# EAGLE design mainv4 (EAGLE 9.2.0)
Custom Smart 12V Battery control system.
CNAME: Caravan 12V Control System; CREVISION: 4.0; DESIGNER: Tim McConnell, M0THM

## Sheet 1 of 2
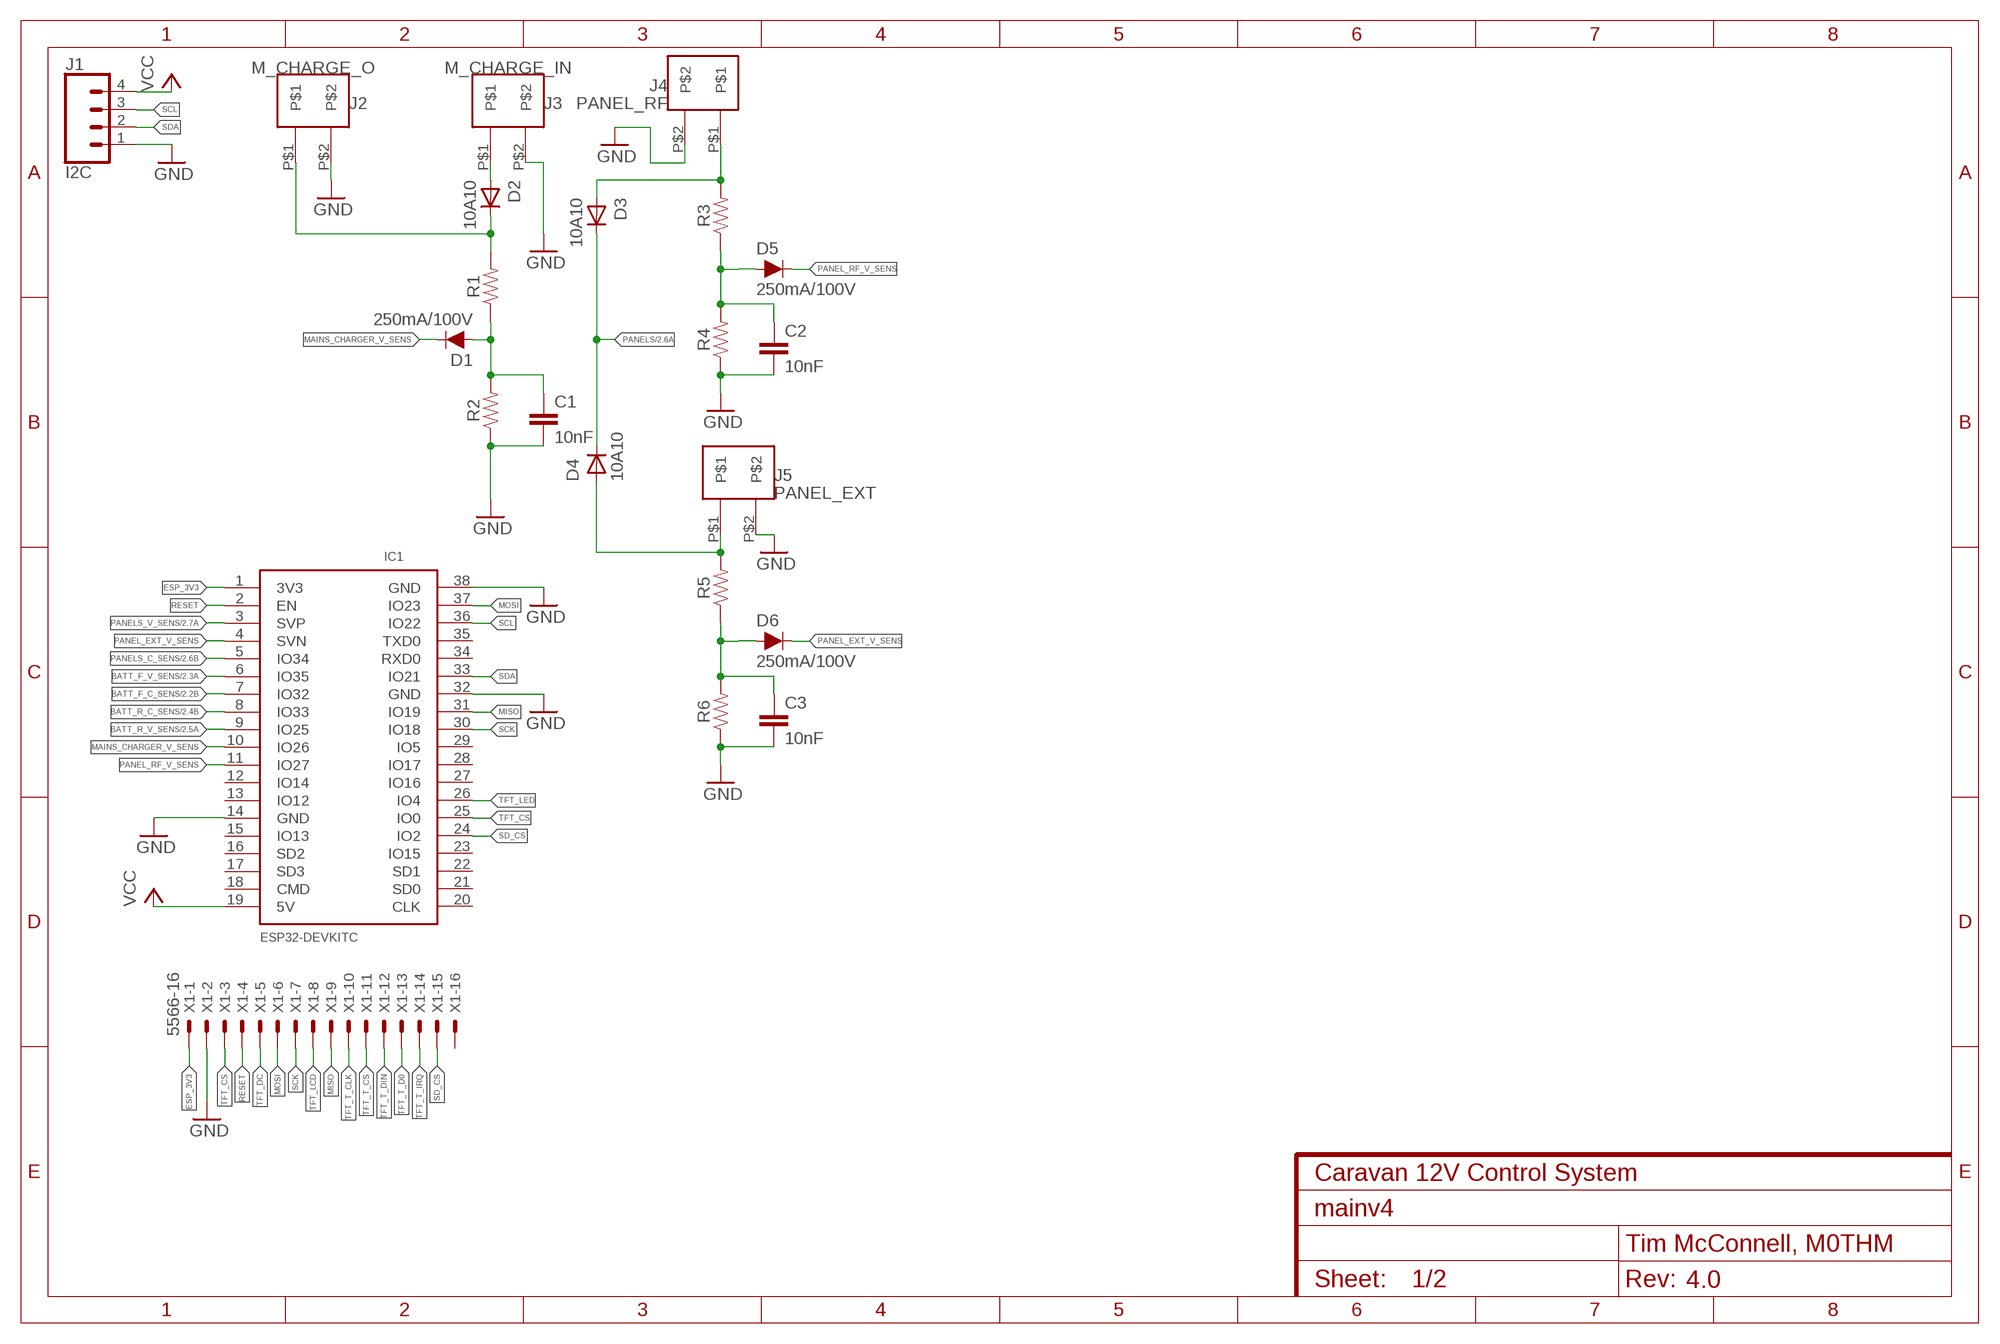
[diagram p0: schematic, sheet 1]

### Parts
C1  10nF  10NF-0603-50V-10%  [0603]
C2  10nF  10NF-0603-50V-10%  [0603]
C3  10nF  10NF-0603-50V-10%  [0603]
D1  250mA/100V  DIODE-BAS16J  [SOD-323]
D2  10A10  [AG]
D3  10A10  [AG]
D4  10A10  [AG]
D5  250mA/100V  DIODE-BAS16J  [SOD-323]
D6  250mA/100V  DIODE-BAS16J  [SOD-323]
IC1  ESP32DEVKITC  [ESP32-DEVKITC]
J1  I2C  CONN_04POLAR  [MOLEX-1X4]
J2  M_CHARGE_O  40A-2PIN  [40A-2PIN]
J3  M_CHARGE_IN  40A-2PIN  [40A-2PIN]
J4  PANEL_RF  40A-2PIN  [40A-2PIN]
J5  PANEL_EXT  40A-2PIN  [40A-2PIN]
R1  RESISTOR0805  [0805]
R2  RESISTOR0805  [0805]
R3  RESISTOR0805  [0805]
R4  RESISTOR0805  [0805]
R5  RESISTOR0805  [0805]
R6  RESISTOR0805  [0805]
X1  5566-16  [5566-16]

### Nets
BATT_F_C_SENS: IC1.7(IO32) ; also sheet 2
BATT_F_V_SENS: IC1.6(IO35) ; also sheet 2
BATT_R_C_SENS: IC1.8(IO33) ; also sheet 2
BATT_R_V_SENS: IC1.9(IO25) ; also sheet 2
ESP_3V3: IC1.1(3V3) X1.1
GND: C1.2 C2.2 C3.2 IC1.14(GND) IC1.32(GND) IC1.38(GND) J1.1 J2.P$2 J3.P$2 J4.P$2 J5.P$2 R2.1 R4.1 R6.1 X1.2 ; also sheet 2
MAINS_CHARGER_V_SENS: D1.C IC1.10(IO26)
MISO: IC1.31(IO19) X1.9
MOSI: IC1.37(IO23) X1.6
N$1: D2.A J3.P$1
N$2: D2.C J2.P$1 R1.2
N$13: D3.A J4.P$1 R3.2
N$14: C2.1 D5.A R3.1 R4.2
N$15: C3.1 D6.A R5.1 R6.2
N$16: D4.A J5.P$1 R5.2
N$17: C1.1 D1.A R1.1 R2.2
PANEL_EXT_V_SENS: D6.C IC1.4(SVN)
PANEL_RF_V_SENS: D5.C IC1.11(IO27)
PANELS: D3.C D4.C ; also sheet 2
PANELS_C_SENS: IC1.5(IO34) ; also sheet 2
PANELS_V_SENS: IC1.3(SVP) ; also sheet 2
RESET: IC1.2(EN) X1.4
SCK: IC1.30(IO18) X1.7
SCL: IC1.36(IO22) J1.3
SD_CS: IC1.24(IO2) X1.15
SDA: IC1.33(IO21) J1.2
TFT_CS: IC1.25(IO0) X1.3
TFT_DC: X1.5
TFT_LCD: X1.8
TFT_LED: IC1.26(IO4)
TFT_T_CLK: X1.10
TFT_T_CS: X1.11
TFT_T_D0: X1.13
TFT_T_DIN: X1.12
TFT_T_IRQ: X1.14
VCC: IC1.19(5V) J1.4 ; also sheet 2
Unconnected: IC1.12(IO14) IC1.13(IO12) IC1.15(IO13) IC1.16(SD2) IC1.17(SD3) IC1.18(CMD) IC1.20(CLK) IC1.21(SD0) IC1.22(SD1) IC1.23(IO15) IC1.27(IO16) IC1.28(IO17) IC1.29(IO5) IC1.34(RXD0) IC1.35(TXD0) X1.16

## Sheet 2 of 2
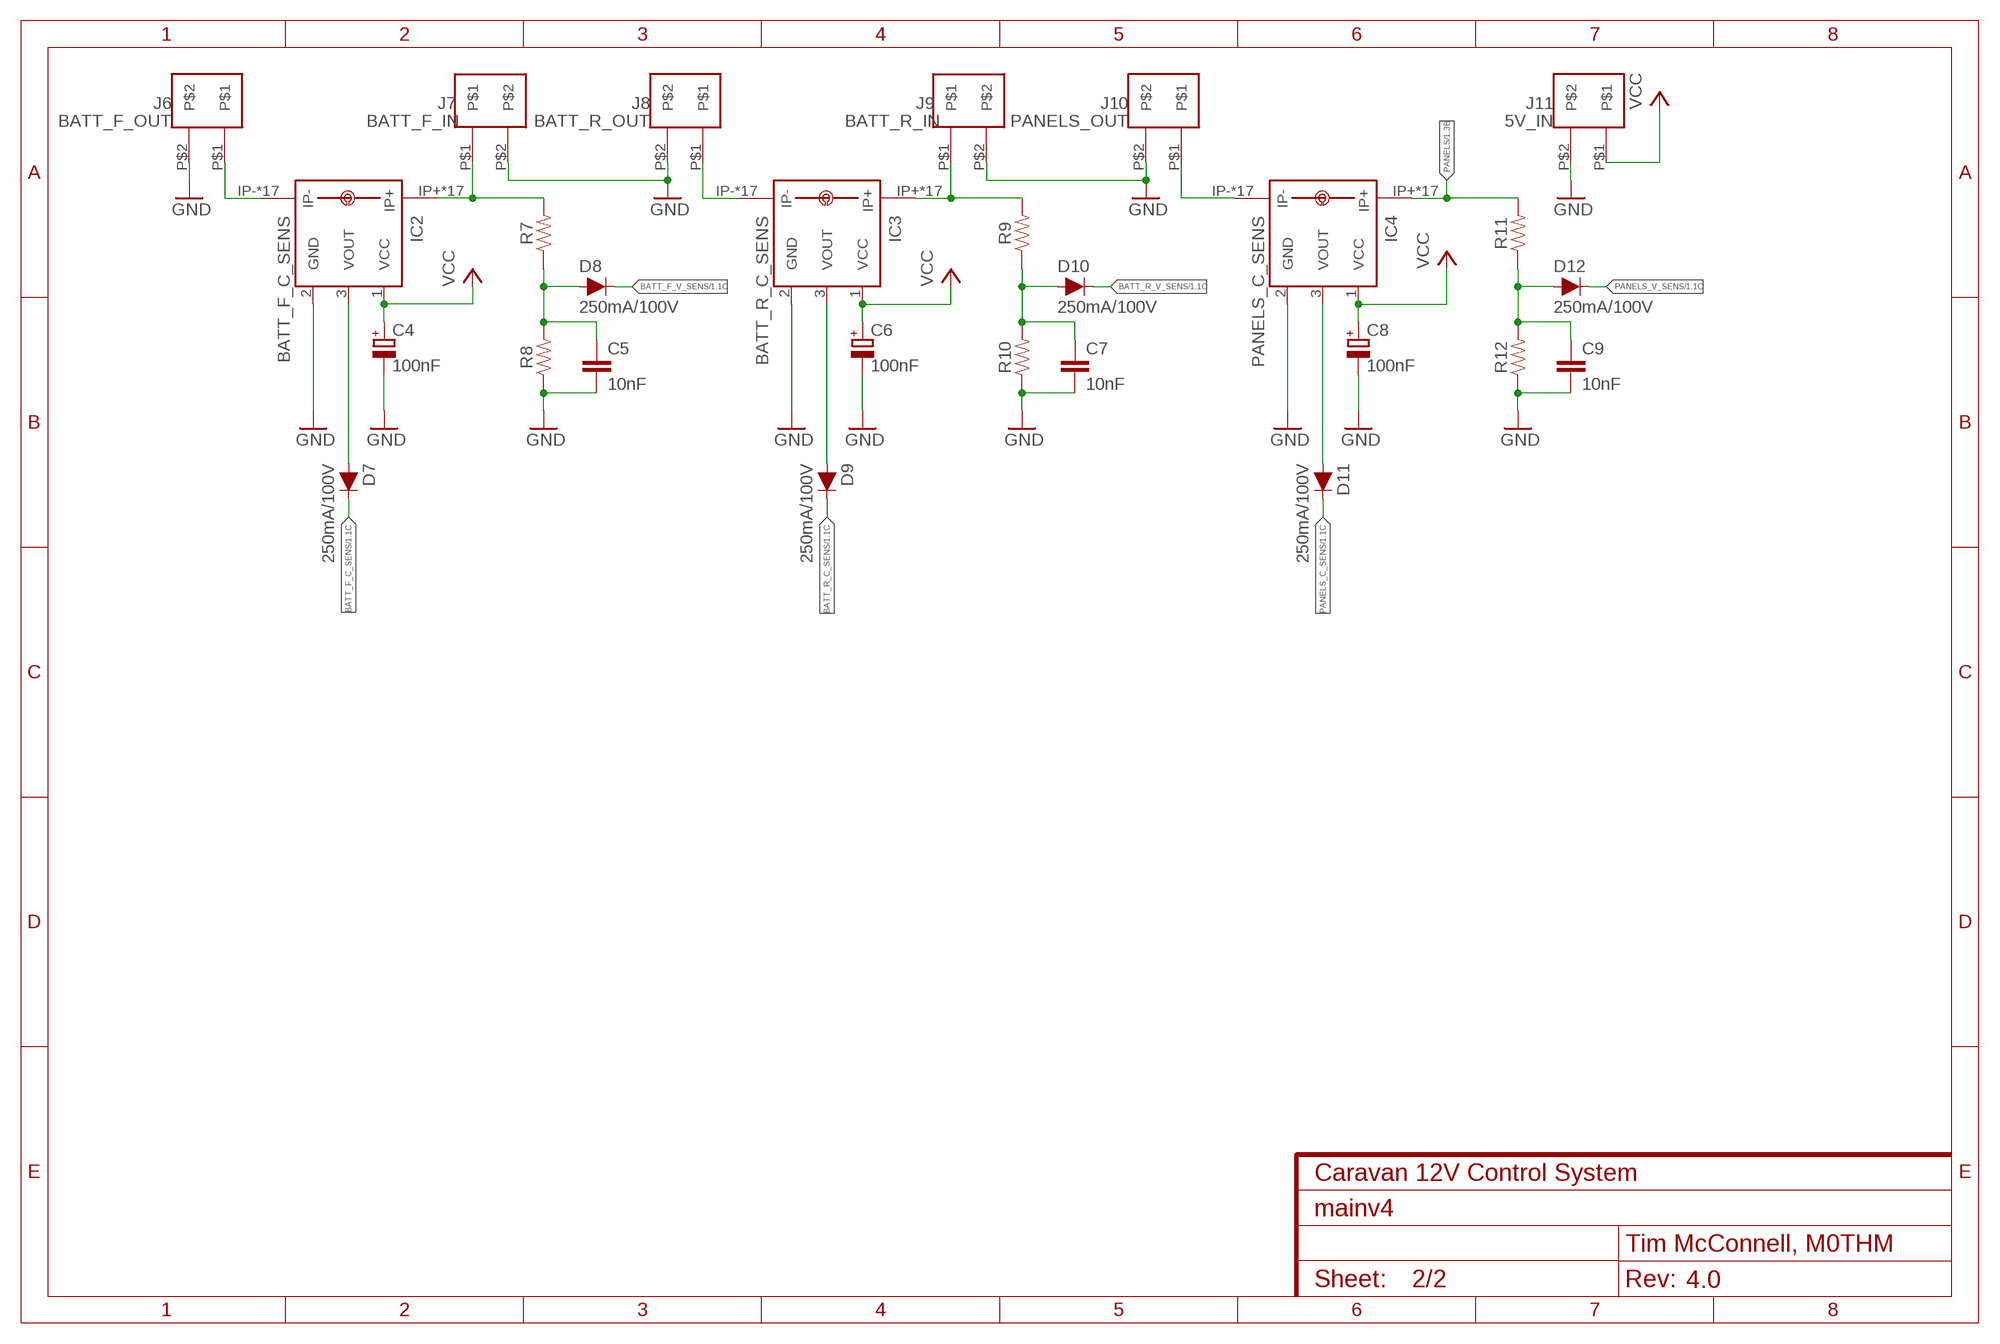
[diagram p1: schematic, sheet 2]

### Parts
C4  100nF  CPOL-EUE  [PANASONIC_E]
C5  10nF  10NF-0603-50V-10%  [0603]
C6  100nF  CPOL-EUE  [PANASONIC_E]
C7  10nF  10NF-0603-50V-10%  [0603]
C8  100nF  CPOL-EUE  [PANASONIC_E]
C9  10nF  10NF-0603-50V-10%  [0603]
D7  250mA/100V  DIODE-BAS16J  [SOD-323]
D8  250mA/100V  DIODE-BAS16J  [SOD-323]
D9  250mA/100V  DIODE-BAS16J  [SOD-323]
D10  250mA/100V  DIODE-BAS16J  [SOD-323]
D11  250mA/100V  DIODE-BAS16J  [SOD-323]
D12  250mA/100V  DIODE-BAS16J  [SOD-323]
IC2  BATT_F_C_SENS  ACS758ECB-200B-PFF-T  [CB-PFF]
IC3  BATT_R_C_SENS  ACS758ECB-200B-PFF-T  [CB-PFF]
IC4  PANELS_C_SENS  ACS758ECB-200B-PFF-T  [CB-PFF]
J6  BATT_F_OUT  40A-2PIN  [40A-2PIN]
J7  BATT_F_IN  40A-2PIN  [40A-2PIN]
J8  BATT_R_OUT  40A-2PIN  [40A-2PIN]
J9  BATT_R_IN  40A-2PIN  [40A-2PIN]
J10  PANELS_OUT  40A-2PIN  [40A-2PIN]
J11  5V_IN  40A-2PIN  [40A-2PIN]
R7  RESISTOR0805  [0805]
R8  RESISTOR0805  [0805]
R9  RESISTOR0805  [0805]
R10  RESISTOR0805  [0805]
R11  RESISTOR0805  [0805]
R12  RESISTOR0805  [0805]

### Nets
BATT_F_C_SENS: D7.C ; also sheet 1
BATT_F_V_SENS: D8.C ; also sheet 1
BATT_R_C_SENS: D9.C ; also sheet 1
BATT_R_V_SENS: D10.C ; also sheet 1
GND: C4.- C5.2 C6.- C7.2 C8.- C9.2 IC2.2(GND) IC3.2(GND) IC4.2(GND) J6.P$2 J7.P$2 J8.P$2 J9.P$2 J10.P$2 J11.P$2 R8.1 R10.1 R12.1 ; also sheet 1
N$3: IC2.IP- IC2.IP-@2(IP-) IC2.IP-@3(IP-) IC2.IP-@4(IP-) IC2.IP-@5(IP-) IC2.IP-@6(IP-) IC2.IP-@7(IP-) IC2.IP-@8(IP-) IC2.IP-@9(IP-) IC2.IP-@10(IP-) IC2.IP-@11(IP-) IC2.IP-@12(IP-) IC2.IP-@13(IP-) IC2.IP-@14(IP-) IC2.IP-@15(IP-) IC2.IP-@16(IP-) IC2.IP-@17(IP-) J6.P$1
N$11: D7.A IC2.3(VOUT)
N$20: IC2.IP+ IC2.IP+@2(IP+) IC2.IP+@3(IP+) IC2.IP+@4(IP+) IC2.IP+@5(IP+) IC2.IP+@6(IP+) IC2.IP+@7(IP+) IC2.IP+@8(IP+) IC2.IP+@9(IP+) IC2.IP+@10(IP+) IC2.IP+@11(IP+) IC2.IP+@12(IP+) IC2.IP+@13(IP+) IC2.IP+@14(IP+) IC2.IP+@15(IP+) IC2.IP+@16(IP+) IC2.IP+@17(IP+) J7.P$1 R7.2
N$21: C5.1 D8.A R7.1 R8.2
N$22: D9.A IC3.3(VOUT)
N$23: IC3.IP- IC3.IP-@2(IP-) IC3.IP-@3(IP-) IC3.IP-@4(IP-) IC3.IP-@5(IP-) IC3.IP-@6(IP-) IC3.IP-@7(IP-) IC3.IP-@8(IP-) IC3.IP-@9(IP-) IC3.IP-@10(IP-) IC3.IP-@11(IP-) IC3.IP-@12(IP-) IC3.IP-@13(IP-) IC3.IP-@14(IP-) IC3.IP-@15(IP-) IC3.IP-@16(IP-) IC3.IP-@17(IP-) J8.P$1
N$24: IC3.IP+ IC3.IP+@2(IP+) IC3.IP+@3(IP+) IC3.IP+@4(IP+) IC3.IP+@5(IP+) IC3.IP+@6(IP+) IC3.IP+@7(IP+) IC3.IP+@8(IP+) IC3.IP+@9(IP+) IC3.IP+@10(IP+) IC3.IP+@11(IP+) IC3.IP+@12(IP+) IC3.IP+@13(IP+) IC3.IP+@14(IP+) IC3.IP+@15(IP+) IC3.IP+@16(IP+) IC3.IP+@17(IP+) J9.P$1 R9.2
N$25: C7.1 D10.A R9.1 R10.2
N$26: D11.A IC4.3(VOUT)
N$27: IC4.IP- IC4.IP-@2(IP-) IC4.IP-@3(IP-) IC4.IP-@4(IP-) IC4.IP-@5(IP-) IC4.IP-@6(IP-) IC4.IP-@7(IP-) IC4.IP-@8(IP-) IC4.IP-@9(IP-) IC4.IP-@10(IP-) IC4.IP-@11(IP-) IC4.IP-@12(IP-) IC4.IP-@13(IP-) IC4.IP-@14(IP-) IC4.IP-@15(IP-) IC4.IP-@16(IP-) IC4.IP-@17(IP-) J10.P$1
N$28: C9.1 D12.A R11.1 R12.2
PANELS: IC4.IP+ IC4.IP+@2(IP+) IC4.IP+@3(IP+) IC4.IP+@4(IP+) IC4.IP+@5(IP+) IC4.IP+@6(IP+) IC4.IP+@7(IP+) IC4.IP+@8(IP+) IC4.IP+@9(IP+) IC4.IP+@10(IP+) IC4.IP+@11(IP+) IC4.IP+@12(IP+) IC4.IP+@13(IP+) IC4.IP+@14(IP+) IC4.IP+@15(IP+) IC4.IP+@16(IP+) IC4.IP+@17(IP+) R11.2 ; also sheet 1
PANELS_C_SENS: D11.C ; also sheet 1
PANELS_V_SENS: D12.C ; also sheet 1
VCC: C4.+ C6.+ C8.+ IC2.1(VCC) IC3.1(VCC) IC4.1(VCC) J11.P$1 ; also sheet 1

## Library data of the parts
C1-C3 C5 C7 C9 = SparkFun-Capacitors:10NF: 0.01uF/10nF/10,000pF ceramic capacitors A capacitor is a passive two-terminal electrical component used to store electrical energy temporarily in an electric field. CAP-09321; PROD_ID: CAP-00867
C4 C6 C8 = rcl:CPOL-EU: POLARIZED CAPACITOR, European symbol; SPICEPREFIX: C
D1 D5-D12 = SparkFun-DiscreteSemi:DIODE: Diode These are standard reverse protection diodes and small signal diodes. SparkFun Products: SparkFun SparkPunk Sound Kit <https://www.sparkfun.com/products/11177> SparkFun ESP8266 Thing <https://www.sparkfun.com/products/13231>; PROD_ID: DIO-09646
D2-D4 = m0thm:10A10
IC1 = ESP32-DEVKITC:ESP32DEVKITC
IC2-IC4 = allegro-2:ACS758*: Thermally Enhanced, Fully Integrated, Hall Effect-Based Linear Current Sensor with 100 micro Ohm Current Conductor display layer 49 Reference in BRD and place VIAs on circles Source: http://www.allegromicro.com/en/Products/Part_Numbers/0758/0758.pdf; MPN: ACS758ECB-200B-PFF-T; OC_FARNELL: 1718993; OC_NEWARK: 04R7127
J1 = SparkFun-Connectors:CONN_04: Multi connection point. Often used as Generic Header-pin footprint for 0.1 inch spaced/style header connections On any of the 0.1 inch spaced packages, you can populate with these: Break Away Headers - Straight <https://www.sparkfun.com/products/116> (PRT-00116) Break Away Male Headers - Right Angle <https://www.sparkfun.com/products/553> (PRT-00553) Female Headers <https://www.sparkfun.com/products/115> (PRT-00115) Break Away Headers - Machine Pin <https://www.sparkfun.com/products/117> (PRT-00117) Break Away Female Headers - Swiss Machine Pin <https://www.sparkfun.com/products/743> (PRT-00743) For SCREWTERMINALS and SPRING TERMINALS visit here: Screw Terimnals on SparkFun.com <https://www.sparkfun.com/search/results?term=Screw+Terminals> (5mm/3.5mm/2.54mm spacing) This device is also useful as a general connection point to wire up your design to another part of your project. Our various solder wires solder well into these plated through hole pads. Hook-Up Wire - Assortment (Stranded, 22 AWG) <https://www.sparkfun.com/products/11375> (PRT-11375) Hook-Up Wire - Assortment (Solid Core, 22 AWG) <https://www.sparkfun.com/products/11367> (PRT-11367) View the entire wire category on our website here <https://www.sparkfun.com/categories/141> Special notes: Molex polarized connector foot print use with SKU : PRT-08231 with associated crimp pins and housings. 1MM SMD Version SKU: PRT-10208; PROD_ID: CONN-08186; SF_ID: PRT-08231
J2-J11 = m0thm:40A-2PIN
R1-R12 = SparkFun-Resistors:RESISTOR: Generic Resistor Package
X1 = con-molex:5566-16: Mini FIT connector 16 pol Source: http://www.molex.com; MF: MOLEX; OC_FARNELL: unknown; OC_NEWARK: unknown

## Board
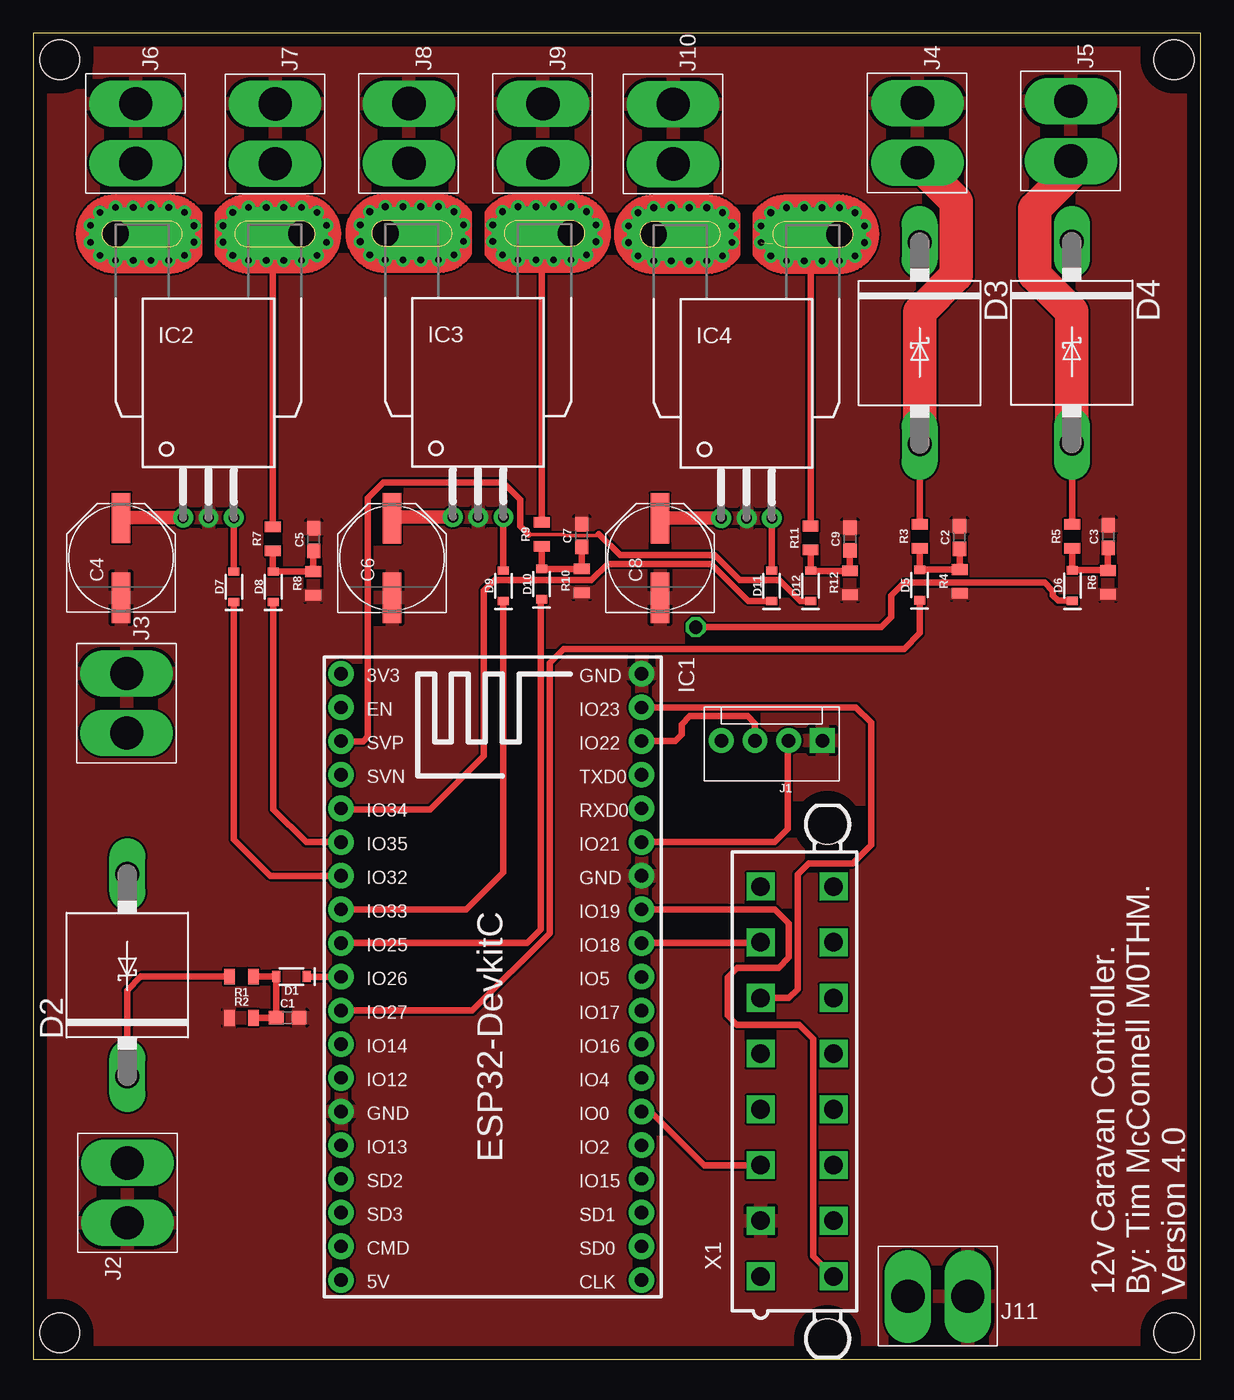
[diagram p2: board, top side]
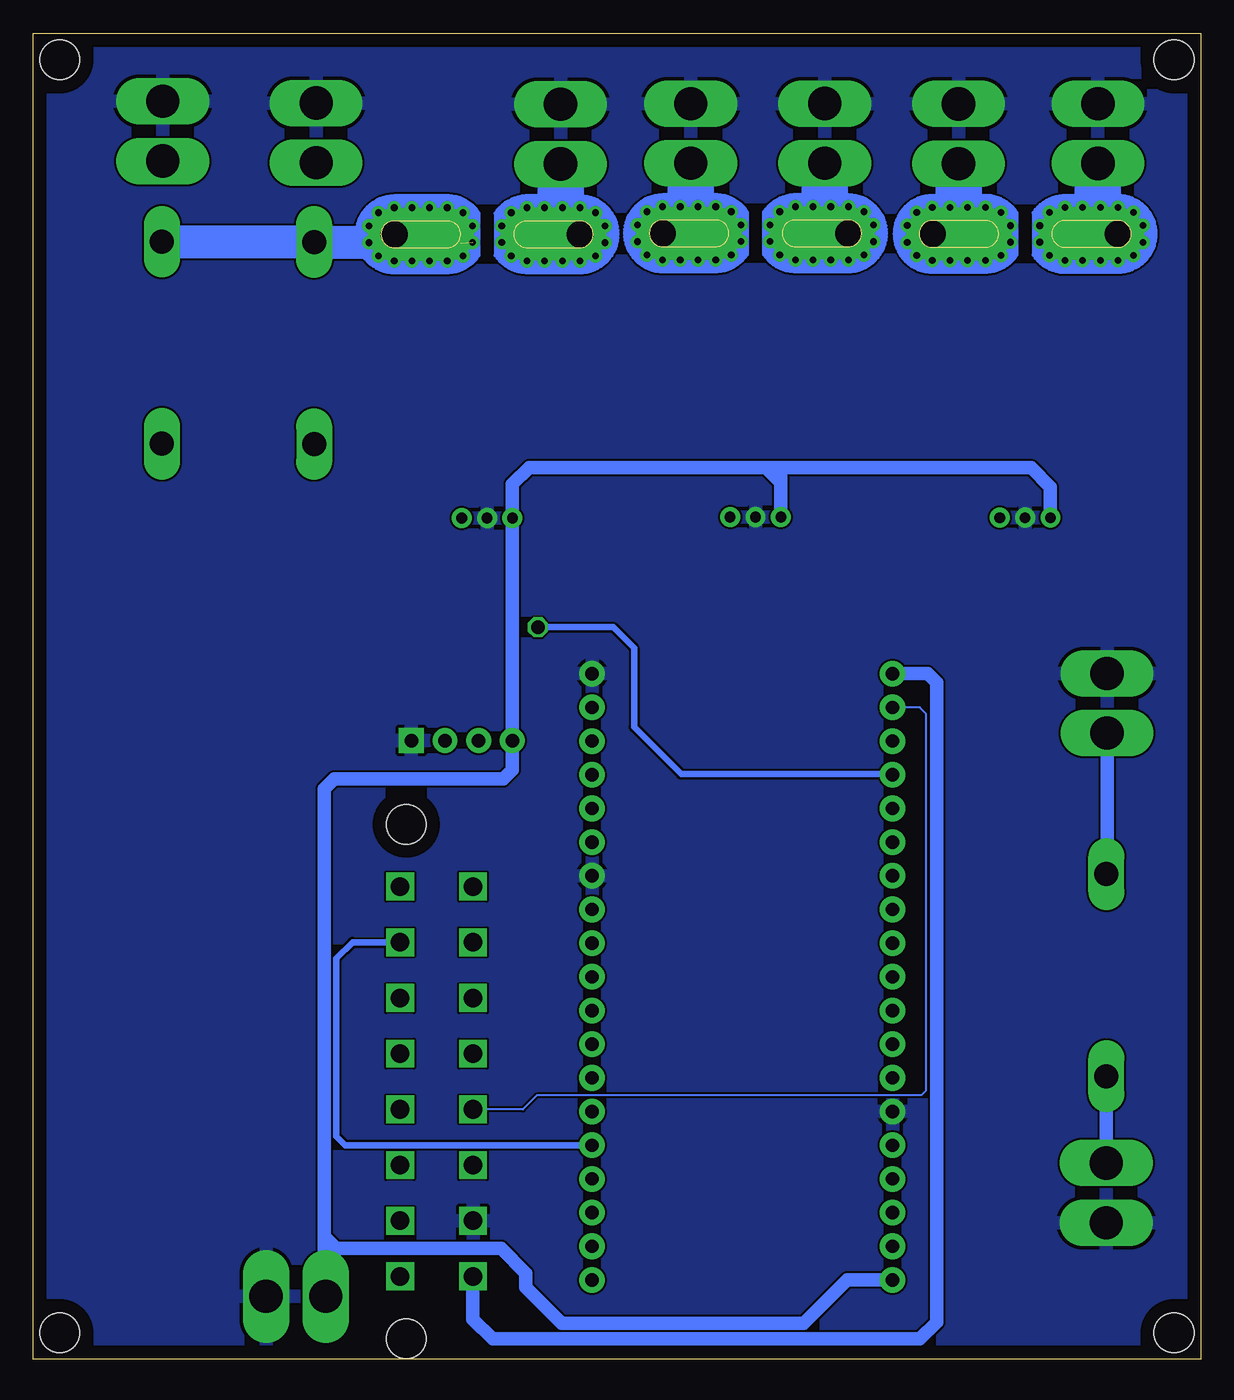
[diagram p3: board, bottom side, seen from below]

Size 88 x 100 mm. Coordinates in mm from the lower left corner, seen from the top.
Outline: 0,0 88,0 88,100 0,100 0,0
Copper layers (1*16): Top 0.035mm / dielectric 1.5mm / Bottom 0.035mm
Design rules "default": minimum track width 6mil, minimum drill 0.35mm, track to track 6mil, track to pad 6mil, pad to pad 6mil, via to via 6mil, smd to smd 6mil, copper to edge 40mil, drill to drill 6mil, minimum pad ring 10mil, minimum via ring 8mil, stop-mask expansion 4mil, vias tented up to drill 0mil, thermal gap 10mil
Holes 3 mm at 2,2 86,2 86,98 2,98

### Footprints (pad centres in the part's own frame; a part is rotated, then mirrored left to right if it is on the bottom)
0603 = smd 1.1 x 1: 1 -0.85,0; 2 0.85,0
PANASONIC_E = smd 3.8 x 1.4: + 3,0; - -3,0
SOD-323 = smd 0.63 x 0.83: A 1.15,0; C -1.15,0
AG = drill 1.803 long: A 7.62,0; C -7.62,0
ESP32-DEVKITC = drill 1 pad 1.93: 1 -22.87,-11.42; 2 -20.33,-11.42; 3 -17.79,-11.42; 4 -15.25,-11.42; 5 -12.71,-11.42; 6 -10.17,-11.42; 7 -7.63,-11.42; 8 -5.09,-11.42; 9 -2.55,-11.42; 10 -0.01,-11.42; 11 2.53,-11.42; 12 5.07,-11.42; 13 7.61,-11.42; 14 10.15,-11.42; 15 12.69,-11.42; 16 15.23,-11.42; 17 17.77,-11.42; 18 20.31,-11.42; 19 22.85,-11.42; 20 22.85,11.23; 21 20.31,11.23; 22 17.77,11.23; 23 15.23,11.23; 24 12.69,11.23; 25 10.15,11.23; 26 7.61,11.23; 27 5.07,11.23; 28 2.53,11.23; 29 -0.01,11.23; 30 -2.55,11.23; 31 -5.09,11.23; 32 -7.63,11.23; 33 -10.17,11.23; 34 -12.71,11.23; 35 -15.25,11.23; 36 -17.79,11.23; 37 -20.33,11.23; 38 -22.87,11.23
CB-PFF = drill 0.8 pad 1.5: 1 -1.91,-21.4; 2 0,-21.4; 3 1.91,-21.4 | drill 2 pad 4 offset: IP+ 7,0; IP- -7,0 | drill 0.5 pad 0.9: IP+@2 8.89,0.635; IP+@3 8.89,-0.635; IP+@4 8.175,-1.625; IP+@5 7,-2; IP+@6 5.675,-2; IP+@7 4.35,-2; IP+@8 3,-2; IP+@9 1.825,-1.625; IP+@10 1.1,-0.625; IP+@11 1.1,0.625; IP+@12 1.825,1.625; IP+@13 3,2; IP+@14 4.35,2; IP+@15 5.675,2; IP+@16 7,2; IP+@17 8.175,1.625; IP-@2 -8.89,0.635; IP-@3 -8.89,-0.635; IP-@4 -8.175,-1.625; IP-@5 -7,-2; IP-@6 -5.675,-2; IP-@7 -4.325,-2; IP-@8 -3,-2; IP-@9 -1.825,-1.625; IP-@10 -1.1,-0.625; IP-@11 -1.1,0.625; IP-@12 -1.825,1.625; IP-@13 -3,2; IP-@14 -4.325,2; IP-@15 -5.675,2; IP-@16 -7,2; IP-@17 -8.175,1.625
MOLEX-1X4 = drill 1.016 pad 1.88 square: 1 0,0 | drill 1.016 pad 1.88: 2 2.54,0; 3 5.08,0; 4 7.62,0
40A-2PIN = drill 2.5 long: P$1 -2.25,-0.02; P$2 2.25,-0.02
0805 = smd 0.8 x 1.2: 1 -0.9,0; 2 0.9,0
5566-16 = drill 1.4 square: 1 14.7,-2.75; 2 10.5,-2.75; 3 6.3,-2.75; 4 2.1,-2.75; 5 -2.1,-2.75; 6 -6.3,-2.75; 7 -10.5,-2.75; 8 -14.7,-2.75; 9 14.7,2.75; 10 10.5,2.75; 11 6.3,2.75; 12 2.1,2.75; 13 -2.1,2.75; 14 -6.3,2.75; 15 -10.5,2.75; 16 -14.7,2.75 | hole 3: 19.4,2.29; -19.4,2.29

### Placement (x,y rotation side)
C1  19.18,25.75 0 top
C2  69.83,61.98 90 top
C3  81.05,62.02 90 top
C4  6.63,60.44 90 top
C5  21.15,61.8 90 top
C6  27.05,60.42 90 top
C7  41.35,62.1 90 top
C8  47.26,60.41 90 top
C9  61.58,61.85 90 top
D1  19.48,28.85 180 top
D2  7.1,28.96 90 top
D3  66.83,76.63 270 top
D4  78.3,76.66 270 top
D5  66.83,58.38 90 top
D6  78.35,58.35 90 top
D7  15.12,58.25 90 top
D8  18.1,58.25 90 top
D9  35.45,58.33 90 top
D10  38.33,58.45 90 top
D11  55.67,58.33 90 top
D12  58.6,58.33 90 top
IC1  34.63,28.82 270 top
IC2  13.22,84.86 0 top
IC3  33.55,84.91 0 top
IC4  53.78,84.83 0 top
J1  59.49,46.65 180 top
J2  7.12,12.54 270 top
J3  7.03,49.47 90 top
J4  66.64,92.48 90 top
J5  78.21,92.61 90 top
J6  7.71,92.43 90 top
J7  18.22,92.41 90 top
J8  28.31,92.44 90 top
J9  38.41,92.44 90 top
J10  48.23,92.39 90 top
J11  68.19,4.75 0 top
R1  15.7,28.85 180 top
R2  15.7,25.75 0 top
R3  66.85,62.05 90 top
R4  69.85,58.65 90 top
R5  78.33,62.05 90 top
R6  81.03,58.58 90 top
R7  18.07,61.88 90 top
R8  21.12,58.5 90 top
R9  38.33,62.2 90 top
R10  41.35,58.7 90 top
R11  58.6,61.92 90 top
R12  61.58,58.55 90 top
X1  57.59,20.94 270 top

### Tracks (layer width: path | path; a pad name or v marks a point on that pad's centre or on a via)
BATT_F_C_SENS
  Top 0.508: D7.C 15.12,39.2 17.88,36.45 IC1.7
BATT_F_V_SENS
  Top 0.508: D8.C 18.1,41.48 20.58,38.99 IC1.6
BATT_R_C_SENS
  Top 0.508: D9.C 35.45,36.73 32.65,33.92 23.23,33.92 IC1.8
BATT_R_V_SENS
  Top 0.508: IC1.9 37.25,31.38 38.27,32.4 38.27,57.25 D10.C
ESP_3V3
  Bottom 1.016: IC1.1 20.57,51.7 19.9,51.02 19.9,2.8 21.18,1.52 53.35,1.52 54.85,3.02 X1.1
GND
  pour Bottom: -0.33,-0.15 -0.33,99.88 88.15,99.88 88.15,12.5 100.5,0.15 100.5,0.03 0,0.03
  pour Top: 0.47,99.92 88.12,99.92 88.12,0.23 0.23,0.23
MAINS_CHARGER_V_SENS
  Top 0.508: D1.C 20.64,28.84 IC1.10
MISO
  Top 0.508: X1.9 58.83,7.75 58.83,24.15 57.75,25.23 53.05,25.23 52.35,25.93 52.35,28.8 53.08,29.52 56.2,29.52 56.97,30.29 56.97,32.86 55.91,33.91 IC1.31
MOSI
  Top 0.508: X1.6 56.97,27.24 57.62,27.9 57.62,36.58 58.45,37.4 61.8,37.4 63.17,38.77 63.17,48 62.02,49.15 IC1.37
N$1
  Bottom 1.016: J3.P$1 7.04,36.63 D2.A
N$2
  Top 0.508: R1.2 8.12,28.85 7.08,27.8 7.08,21.36 D2.C
  Bottom 1.016: D2.C J2.P$1
N$3
  Bottom 2.54: 7.72,85.47 IC2.IP-
  Bottom 3.5: J6.P$1 7.72,85.47
N$11
  Top 0.508: D7.A IC2.3
N$13
  Top 0.508: D3.A 66.85,68.98 R3.2
  Top 2.54: D3.A 66.83,78.97 69.6,81.75 69.6,87.3 J4.P$1
N$14
  Top 0.508: R3.1 66.83,61.15 D5.A 66.83,59.55 R4.2 69.85,61.12 C2.1
N$15
  Top 0.508: R5.1 78.33,59.5 D6.A 81.03,59.5 R6.2 81.03,61.17 C3.1
N$16
  Top 0.508: R5.2 78.33,69.03 D4.A
  Top 2.54: J5.P$1 78.3,90.3 78.3,89.55 75.52,86.78 75.52,81.77 78.3,79 D4.A
N$17
  Top 0.508: R2.2 C1.1 D1.A R1.1
N$20
  Top 0.508: R7.2 18.07,85 20.22,85 IC2.IP+
  Bottom 2.54: 18.25,85.33 19.65,85.22 IC2.IP+
  Bottom 3.5: 18.25,85.33 J7.P$1
N$21
  Top 0.508: R7.1 18.07,59.42 D8.A R8.2 21.12,60.95 C5.1
N$22
  Top 0.508: D9.A IC3.3
N$23
  Bottom 2.54: 28.32,84.83 IC3.IP-
  Bottom 3.5: J8.P$1 28.32,84.83
N$24
  Top 0.508: R9.2 38.33,84.91 IC3.IP+
  Bottom 2.54: IC3.IP+ 38.42,85.12
  Bottom 3.5: J9.P$1 38.42,85.12
N$25
  Top 0.508: R9.1 D10.A R10.2 C7.1
N$26
  Top 0.508: IC4.3 55.69,59.49 D11.A
N$27
  Bottom 2.54: 48.23,85.03 IC4.IP-
  Bottom 3.5: J10.P$1 48.23,85.03
N$28
  Top 0.508: R11.1 D12.A 58.6,59.45 R12.2 C9.1
PANEL_EXT_V_SENS  (via drill 1)
  Top 0.508: v49.95,55.2 63.92,55.2 64.7,55.98 64.7,57.6 65.66,58.56 76.24,58.56 76.88,57.92 76.88,57.6 77.28,57.2 D6.C
  Bottom 0.508: v49.95,55.2 44.27,55.2 42.7,53.62 42.7,47.67 39.15,44.12 23.27,44.12 IC1.4
PANEL_RF_V_SENS
  Top 0.508: IC1.11 33.1,26.3 38.94,32.13 38.94,52.51 40,53.58 65.65,53.58 66.83,54.75 D5.C
PANELS  (1 unrouted)
  Top 0.508: R11.2 58.6,83.22 60.78,83.22 60.78,84.21 | IC4.IP+ 60.78,84.7 60.78,84.21 | IC4.IP+@10 60.78,84.21
  Bottom 2.54: D4.C D3.C 55.75,84.12
PANELS_C_SENS
  Top 0.508: D11.C 53.92,57.17 51.12,59.98 43.3,59.98 42.08,58.75 34.78,58.75 33.98,57.95 33.98,45.5 29.93,41.45 23.3,41.45 IC1.5
PANELS_V_SENS
  Top 0.254: 42.65,62.23 42.55,62.12 40.08,62.12 40.02,62.17 37.38,62.17
  Top 0.508: D12.C 57.83,57.17 56.25,58.75 53.28,58.75 51.4,60.63 44.24,60.63 42.65,62.23 | IC1.3 23.23,46.6 24.88,46.6 25.23,46.95 25.23,64.95 26.38,66.1 35.45,66.1 36.73,64.83 36.73,62.83 37.38,62.17
RESET
  Bottom 0.152: X1.4 51.09,18.84 50.02,19.9 21.05,19.9 20.68,20.27 20.68,48.67 21.15,49.15 IC1.2
SCK
  Top 0.508: IC1.30 54.77,31.38 X1.7
SCL
  Top 0.508: J1.3 54.41,47.94 53.86,48.49 49.52,48.49 48.88,47.85 48.88,47.1 48.4,46.62 45.88,46.62 IC1.36
SD_CS
  Bottom 0.508: IC1.24 64.46,16.14 65.14,16.81 65.14,30.21 63.91,31.44 X1.15
SDA
  Top 0.508: IC1.33 55.9,38.99 56.9,40 56.9,46.59 J1.2
TFT_CS
  Top 0.508: IC1.25 46.52,18.68 50.58,14.62 54.83,14.62 X1.3
VCC
  Top 1.016: IC2.1 6.66,63.46 C4.+ | IC3.1 27.14,63.51 C6.+ | IC4.1 47.27,63.44 C8.+
  Bottom 1.016: IC2.1 11.31,65.78 12.78,67.25 31.7,67.25 | 31.7,67.25 32.77,67.25 | 31.7,67.25 31.64,67.19 IC3.1 | 32.77,67.25 31.7,66.17 | 32.77,67.25 50.6,67.25 51.87,65.98 IC4.1 J1.4 | J1.4 | IC1.19 23.24,6 26.62,6 29.9,2.73 48.15,2.73 50.85,5.42 50.85,6.47 52.73,8.35 65.08,8.35 65.15,8.35 | J1.4 51.88,44.45 52.58,43.75 65.3,43.75 66.05,43 66.05,9.25 | 66.05,9.25 66.05,8.45 | 66.05,8.45 66.05,4.84 J11.P$1 | 66.05,8.45 65.95,8.35 65.15,8.35 | 65.15,8.35 66.05,9.25

### Text on the board
tNames: 12v Caravan Controller. / By: Tim McConnell M0THM. / Version 4.0